# Altium schematic sheet Connectors.SchDoc
size OrCAD A
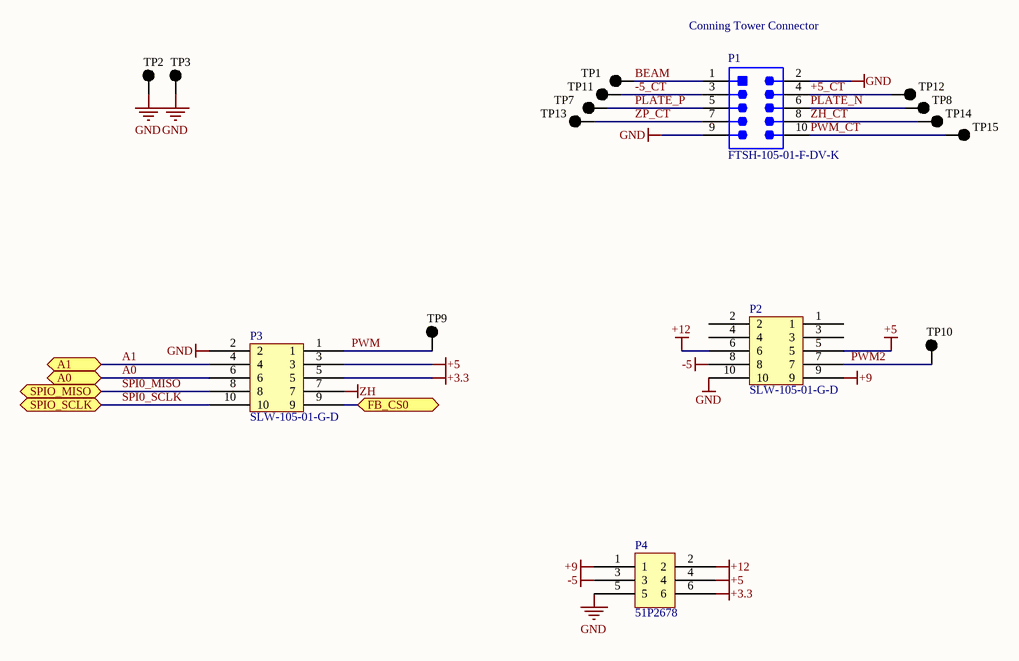
[diagram p0: Connectors.SchDoc]

## Parts
P1  FTSH-105-01-F-DV-K  [SMTC-FTSH-105-01-L-DV-K_V]
P2  SLW-105-01-G-D  [SLW-105-01-G-D]
P3  SLW-105-01-G-D  [SLW-105-01-G-D]
P4  Supplier Part Number 1: 51P2678  [IPL1-103-01-F-D]  (hidden comment: IPL1-103-01-F-D)
TP1  5011  [KSTN-5011_V]  (value not drawn)
TP2  5011  [KSTN-5011_V]  (value not drawn)
TP3  5011  [KSTN-5011_V]  (value not drawn)
TP7  5011  [KSTN-5011_V]  (value not drawn)
TP8  5011  [KSTN-5011_V]  (value not drawn)
TP9  5011  [KSTN-5011_V]  (value not drawn)
TP10  5011  [KSTN-5011_V]  (value not drawn)
TP11  5011  [KSTN-5011_V]  (value not drawn)
TP12  5011  [KSTN-5011_V]  (value not drawn)
TP13  5011  [KSTN-5011_V]  (value not drawn)
TP14  5011  [KSTN-5011_V]  (value not drawn)
TP15  5011  [KSTN-5011_V]  (value not drawn)

## Ports
A0, A1, FB_CS0, SPIO_MISO, SPIO_SCLK

## Nets
+3.3: P3.5 P4.6
+5: P2.5 P3.3 P4.4
+9: P2.9 P4.1
+12: P2.6 P4.2
-5: P2.8 P4.3
GND: P1.2 P1.9 P2.10 P3.2 P4.5 TP2.1 TP3.1
ZH: P3.7
+5_CT: P1.4 TP12.1
-5_CT: P1.3 TP11.1
A0: P3.6 ; port A0
A1: P3.4 ; port A1
BEAM: P1.1 TP1.1
FB_CS0: P3.9 ; port FB_CS0
PLATE_N: P1.6 TP8.1
PLATE_P: P1.5 TP7.1
PWM: P3.1 TP9.1
PWM2: P2.7 TP10.1
PWM_CT: P1.10 TP15.1
SPI0_MISO: P3.8 ; port SPIO_MISO
SPI0_SCLK: P3.10 ; port SPIO_SCLK
ZH_CT: P1.8 TP14.1
ZP_CT: P1.7 TP13.1

Not connected (* = marked no-connect by the designer): P2 1 2 3 4

## Notes on the sheet
- (near P1) Conning Tower Connector
- Title
- Size:
- Date:
- Orcad A
- Number:
- Time:
- Revision:
- Sheet
- of
- ZLS Corporation
- 7801 North Lamar Blvd.
- Suite E-184
- Austin, Texas 78752  USA
- (512) 453-0288
- File:

## Library data of the parts
P1 = CMP-2000-05352-1: Male Header, Pitch 1.27 mm, 2 x 5 Position, Height 6.12 mm, RoHS, Tube; Manufacturer: Samtec; Number of Positions: 10; Connector Type: Header,Shrouded; Number of Positions Loaded: All; Fastening Type: -; Package Reference: FTSH-105-01-L-DV-K; Termination: Solder; Package URL: http://suddendocs.samtec.com/prints/ftsh-1xx-xx-xxx-dv-xxx-footprint.pdf; Number of Rows: 2; Contact Finish Thickness: 3µin(0.08µm); Contact Type: MalePin; Manufacturer URL: http://www.samtec.com/; Series: FTSH; Features: -; Contact Finish: Gold; Color: Black; Family: RectangularConnectors-Headers,MalePins; Datasheet URL: http://suddendocs.samtec.com/prints/ftsh-1xx-xx-xxx-dv-xxx-mkt.pdf; Package Description: Male Header, Pitch 1.27 mm, 2 x 5 Position, Height 5.97 mm, Tail Length 4.32 mm; Mounting Type: SurfaceMount; Datasheet Version: Rev. ET, 10/1995; Category: Connectors,Interconnects; Packaging: Tube
P2 P3 = SLW-105-01-G-D: CONN RCPT .100" 10POS DUAL GOLD; Manufacturer: Samtec Inc.; Connector Type: Receptacle; Style: Board to Board; Number of Positions: 10; Number of Positions Loaded: All; Pitch - Mating: 0.100" (2.54mm); Contact Length - Post: 0.115" (2.92mm); Mated Stacking Heights: 6.09mm; Supplier 1: Digi-Key; Supplier Part Number 1: SAM1088-05-ND; Manufacturer Part Number: SLW-105-01-G-D; RoHS: RoHS Compliant; Category: Connectors, Interconnects; Stock 1: 203; Pricing 1: 1=3.8, 10=3.401, 100=2.8012, 500=2.2143, 1000=1.90084, 5000=1.7341, 10000=1.6674 (USD); Packaging: Bulk; Part Status: Active; Contact Type: Forked; Row Spacing - Mating: 0.100" (2.54mm); Mounting Type: Through Hole; Termination: Solder; Fastening Type: Push-Pull; Contact Finish - Mating: Gold; Contact Finish Thickness - Mating: 20µin (0.51µm); Insulation Color: Black; Insulation Height: 0.180" (4.57mm); Operating Temperature: -55°C ~ 125°C; Material Flammability Rating: -; Contact Finish - Post: Gold; Ingress Protection: -; Features: -; Current Rating: -; Voltage Rating: -; Applications: -; Insulation Material: Polyester, Glass Filled; Contact Shape: Square; Contact Material: Phosphor Bronze; Contact Finish Thickness - Post: 3µin (0.08µm); ComponentLink1URL: http://suddendocs.samtec.com/prints/slw-1xx-01-x-x-mkt.pdf; ComponentLink1Description: http://suddendocs.samtec.com/prints/slw-1xx-01-x-x-mkt.pdf
TP1-TP3 TP7-TP15 = CMP-1672-00003-4: Test Point, Black, Through Hole, RoHS, Bulk; Manufacturer: Keystone; ComponentLink2URL: http://www.keyelco.com/product-pdf.cfm?p=1320; Colour: Black; Pins: 1; REACH SVHC: No SVHC; ComponentLink1URL: http://www.keyelco.com/; PackageReference: 5011; Contact Plating: Silver; Package Quantity: 100; Packaging: Bulk; RoHSCompliant: true; Height: 8.12 mm; PackageDescription: 1-Pin Through Hole Device, Dia 3.17 mm; Mount: Through Hole; Mounting Technology: Through Hole; DatasheetVersion: Rev. F, 12/2013; ComponentLink1Description: Manufacturer URL; Contact Material: Bronze; ComponentLink2Description: Datasheet
P4 = IPL1-103-01-F-D: Supplier 1: Newark